# EAGLE design one_dollar_boad (EAGLE 7.5.0)
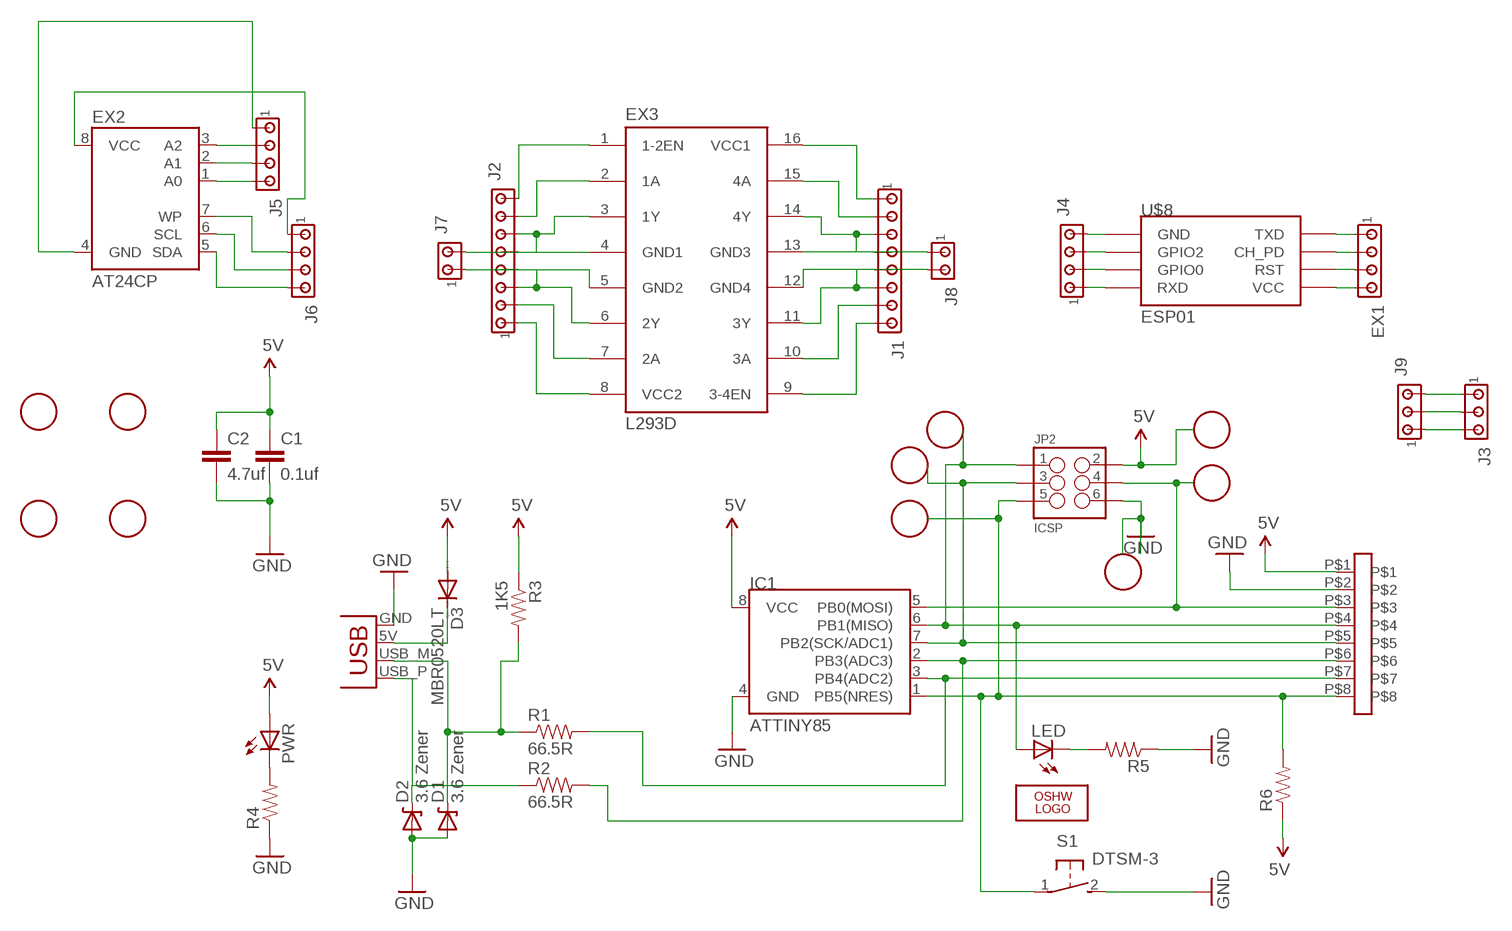
[diagram p0: schematic, sheet 1]

## Parts
C1  0.1uf  CAP0402-CAP  [0402-CAP]
C2  4.7uf  CAP0805  [0805]
CONNECTORBAR1  FAMALEBAR01X08  [FEMEABARRA01X08]
D1  3.6 Zener  DIODE-ZENER-BZT52  [SOD-323]
D2  3.6 Zener  DIODE-ZENER-BZT52  [SOD-323]
D3  MBR0520LT  [SOD123]
EX1  MTA04-100  [10X04MTA]
EX2  AT24CP  [DIL08]
EX3  L293D  [DIL16]
IC1  ATTINY85  ATTINY45  [SO08-EIAJ]
ICSP1  ICSP  [ICSP]
ICSP2  ICSP  [ICSP]
ICSP3  ICSP  [ICSP]
ICSP4  ICSP  [ICSP]
ICSP5  ICSP  [ICSP]
ICSP6  ICSP  [ICSP]
J1  MTA08-100  [10X08MTA]
J2  MTA08-100  [10X08MTA]
J3  MTA03-100  [10X03MTA]
J4  MTA04-100  [10X04MTA]
J5  MTA04-100  [10X04MTA]
J6  MTA04-100  [10X04MTA]
J7  MTA02-100  [10X02MTA]
J8  MTA02-100  [10X02MTA]
J9  MTA03-100  [10X03MTA]
JP2  ICSP  M03X22X3_SILK_MALE_PTH  [2X3]
LED  LED0603  [LED-0603]
LOGO2  LOGO-OSHW-10MILX0200-NT  [OSHW_10X200_NOTEXT]
PWR  LED0603  [LED-0603]
R1  66.5R  RESISTOR0402-RES  [0402-RES]
R2  66.5R  RESISTOR0402-RES  [0402-RES]
R3  1K5  RESISTOR0402-RES  [0402-RES]
R4  RESISTOR0402-RES  [0402-RES]
R5  RESISTOR0402-RES  [0402-RES]
R6  RESISTOR0402-RES  [0402-RES]
S1  DTSM-3  [DTSM-3]
U$8  ESP01  [ESP01]
U$9  ARDUINOPINAGEM  [ARDUINOPINAGEM]
X1  USBPCB  [USB-A-PCB]

## Nets
5V: C1.1 C2.1 CONNECTORBAR1.P$1 D3.A IC1.8(VCC) JP2.2 PWR.A R3.1 R6.1
GND: C1.2 C2.2 CONNECTORBAR1.P$2 D1.2(A) D2.2(A) IC1.4(GND) JP2.6 R4.1 R5.1 S1.2 X1.GND
N$1: CONNECTORBAR1.P$7 IC1.3(PB4(ADC2)) R1.2
N$2: CONNECTORBAR1.P$3 IC1.5(PB0(MOSI)) JP2.4
N$3: CONNECTORBAR1.P$4 IC1.6(PB1(MISO)) JP2.1 LED.A
N$5: CONNECTORBAR1.P$5 IC1.7(PB2(SCK/ADC1)) JP2.3
N$6: CONNECTORBAR1.P$6 IC1.2(PB3(ADC3)) R2.2
N$7: EX3.1(1-2EN) J2.8
N$9: EX3.2(1A) J2.7
N$10: D1.1(C) R1.1 R3.2 X1.USB_M(D-)
N$11: D2.1(C) R2.1 X1.USB_P(D+)
N$12: LED.C R5.2
N$13: EX2.8(VCC) J6.1
N$14: EX2.7(WP) J6.2
N$15: EX3.3(1Y) J2.6 J7.2
N$16: D3.C X1.5V(VBUS)
N$17: PWR.C R4.2
N$18: EX3.8(VCC2) J2.1
N$19: EX3.7(2A) J2.2
N$20: EX3.6(2Y) J2.3 J7.1
N$21: EX3.16(VCC1) J1.1
N$22: EX3.15(4A) J1.2
N$23: EX2.6(SCL) J6.3
N$24: EX2.5(SDA) J6.4
N$25: EX3.14(4Y) J1.3 J8.1
N$26: EX3.9(3-4EN) J1.8
N$27: EX3.10(3A) J1.7
N$28: EX2.3(A2) J5.2
N$29: J4.3 U$8.GPIO2
N$30: J4.2 U$8.GPIO0
N$31: J4.1 U$8.RX(RXD)
N$32: EX1.1 U$8.TX(TXD)
N$33: EX1.2 U$8.CH_PD
N$34: EX1.3 U$8.RST
N$35: EX1.4 U$8.VCC
N$36: EX2.2(A1) J5.3
N$37: EX2.1(A0) J5.4
N$38: EX3.11(3Y) J1.6 J8.2
N$41: CONNECTORBAR1.P$8 IC1.1(PB5(NRES)) JP2.5 R6.2 S1.1
N$46: J4.4 U$8.GND
N$47: EX2.4(GND) J5.1
N$48: EX3.5(GND2) J2.4
N$49: EX3.12(GND4) J1.5
N$50: EX3.13(GND3) J1.4
N$51: EX3.4(GND1) J2.5
N$52: J3.1 J9.3
N$53: J3.2 J9.2
N$54: J3.3 J9.1

## Library data of the parts
C1 C2 = SparkFun:CAP: Capacitor Standard 0603 ceramic capacitor, and 0.1" leaded capacitor.
CONNECTORBAR1 = femeabarra01x08:FAMALEBAR01X08: conector barra femea 01x08 SMD
D1 D2 = SparkFun:DIODE-ZENER: Zener Diode Production Part - 8199 3.4V Zener Voltage
D3 = diode:MBR0520LT: SCHOTTKY BARRIER RECTIFIER Source: http://onsemi.com .. MBR0520LT1-D.pdf
EX1 J4-J6 = con-amp:MTA04-100: AMP connector
EX2 = atmel:AT24C*: 2-wire serial EEPROM; MPN: AT24C1024BW-SH-B; OC_FARNELL: 1362646; OC_NEWARK: 03P2044
EX3 = st-microelectronics:L293D: PUSH-PULL 4 CHANNEL DRIVER; MPN: L293D; OC_FARNELL: 9589619; OC_NEWARK: 56P8249
IC1 = SparkFun:ATTINY45: Atmel ATTiny45
ICSP1-ICSP6 = ICSP:ICSP
J1 J2 = con-amp:MTA08-100: AMP connector
J3 J9 = con-amp:MTA03-100: AMP connector
J7 J8 = con-amp:MTA02-100: AMP connector
JP2 = SparkFun-Connectors:M03X2: 2x3 .1" header. Shrouded, with keying- CONN-10681 SMT- CONN-11415 Pogo pins- HW-11044; PROD_ID: CONN-09701
LED PWR = SparkFun:LED: LEDs Standard schematic elements and footprints for 5mm, 3mm, 1206, and 0603 sized LEDs. 5mm - Spark Fun Electronics SKU : COM-00529 (and others)
LOGO2 = logo:LOGO-OSHW-10MIL
R1-R5 = SparkFun:RESISTOR: Resistor Basic schematic elements and footprints for 0603, 1206, and PTH resistors.
R6 = SparkFun-Passives:RESISTOR: Resistor Basic schematic elements and footprints for 0603, 1206, and PTH resistors.
S1 = switch-tact:DTSM-3
U$8 = esp8266modules:ESP01: ESP8266 Wifi module 01
U$9 = arduinopinagem:ARDUINOPINAGEM
X1 = SparkFun:USB: USB Connectors USB-B-PTH is fully proven SKU : PRT-00139 USB-miniB is fully proven SKU : PRT-00587 USB-A-PCB is untested. USB-A-H is throughly reviewed, but untested. Spark Fun Electronics SKU : PRT-00437 USB-B-SMT is throughly reviewed, but untested. Needs silkscreen touching up. USB-A-S has not been used/tested USB-MB-H has not been used/tested

## Board
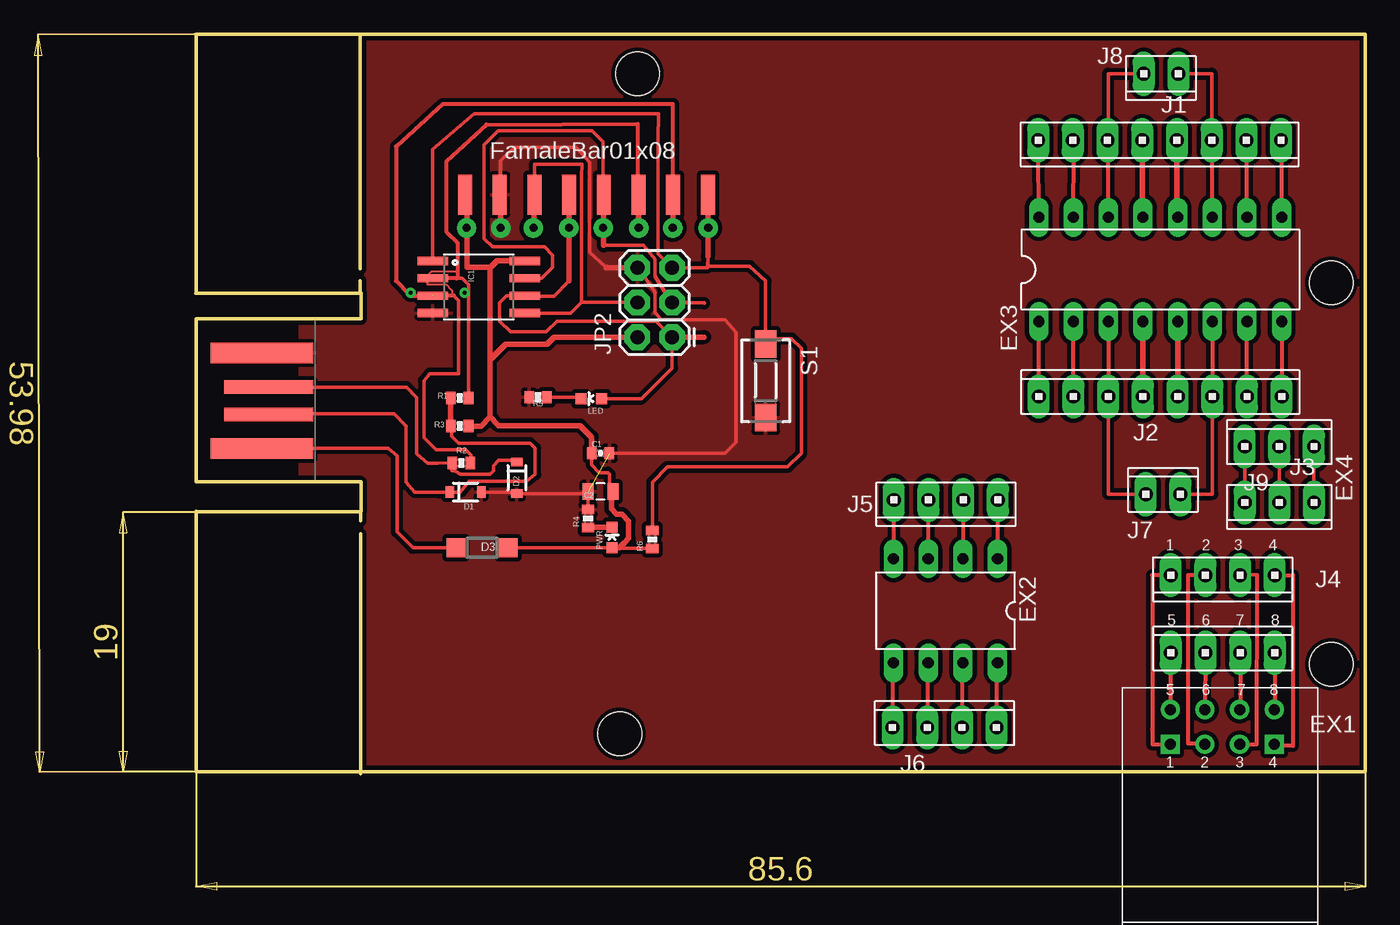
[diagram p1: board, top side]
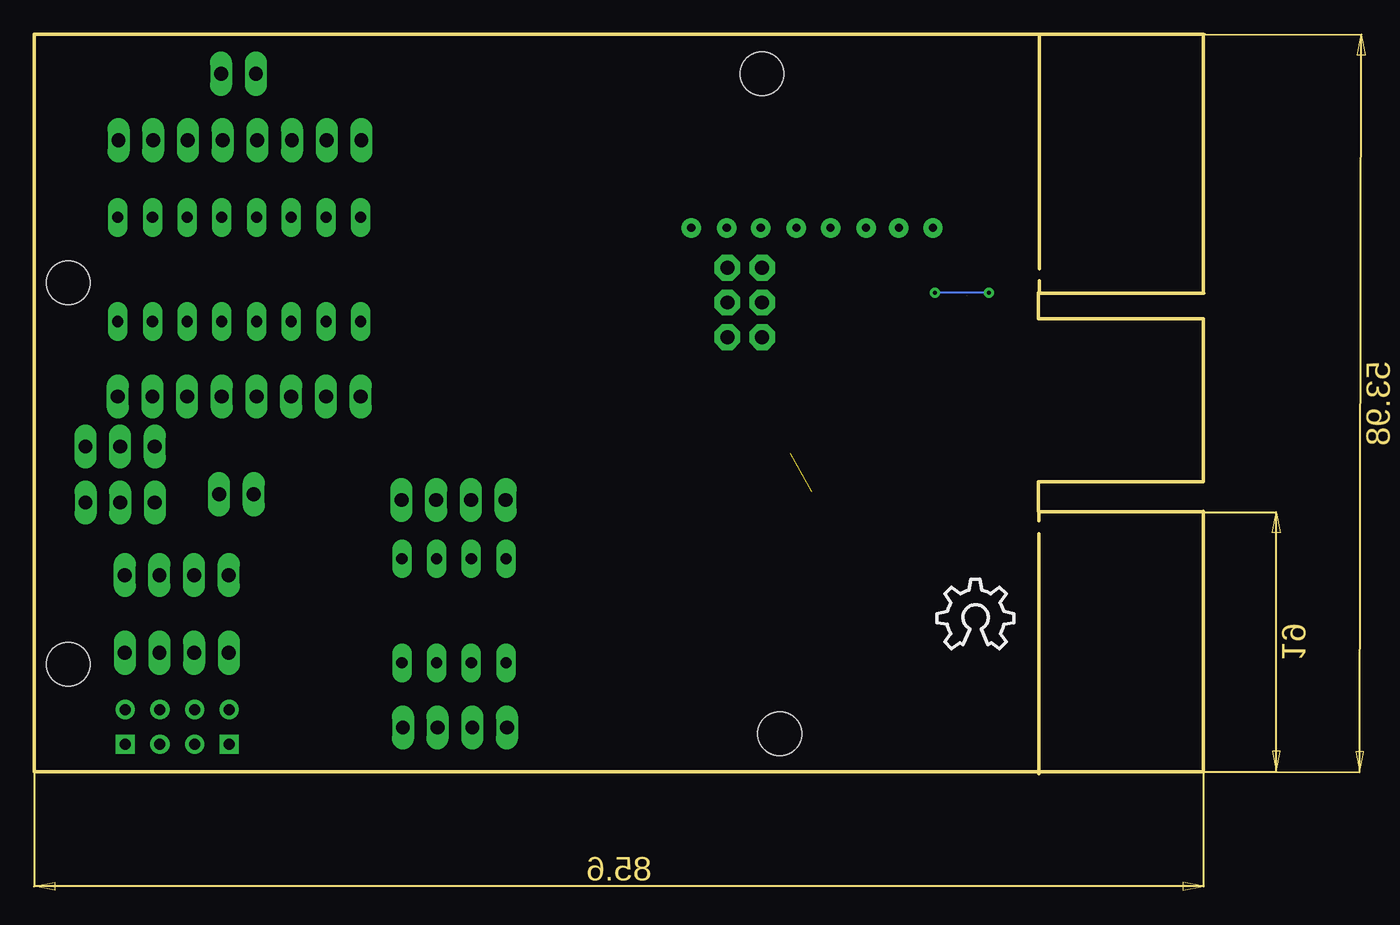
[diagram p2: board, bottom side, seen from below]

Size 85.62 x 54.14 mm. Coordinates in mm from the lower left corner, seen from the top.
Outline: 9.02,0.17 26.52,0.17
Outline: 0.02,19.22 0.02,0.17 85.62,0.17 85.62,54.14 0.02,54.14 0.02,35.22
Outline: 12.08,19.22 12.08,21.38 0.02,21.38 0.02,33.31 12.08,33.31 12.08,35.22
Outline: 12.03,36.11 12.03,35.13
Outline: 12.03,46.6 12.03,45.89
Outline: 12.03,47.72 12.03,47
Outline: 12.03,48.83 12.03,48.12
Outline: 12.03,49.98 12.03,49.26
Outline: 12.03,51.14 12.03,50.43
Outline: 12.03,52.26 12.03,51.55
Outline: 12.03,54.08 12.03,36.97
Outline: 10.79,35.19 11.5,35.19
Outline: 9.67,35.19 10.38,35.19
Outline: 8.55,35.19 9.26,35.19
Outline: 7.38,35.19 8.09,35.19
Outline: 6.27,35.19 6.98,35.19
Outline: 5.15,35.19 5.86,35.19
Outline: 4.03,35.19 4.74,35.19
Outline: 2.91,35.19 3.62,35.19
Outline: 1.8,35.19 2.51,35.19
Outline: 0,35.19 12.06,35.19
Outline: 12.06,18.53 12.06,19.24
Outline: 12.06,12.31 12.06,13.02
Outline: 12.06,11.19 12.06,11.9
Outline: 12.06,7.79 12.06,8.5
Outline: 12.06,6.67 12.06,7.38
Outline: 12.06,5.55 12.06,6.26
Outline: 12.06,4.41 12.06,5.12
Outline: 12.06,3.24 12.06,3.95
Outline: 12.06,2.12 12.06,2.83
Outline: 12.06,0 12.06,17.57
Outline: 0.06,19.19 12.07,19.19
Outline: 9.64,19.19 10.36,19.19
Outline: 8.53,19.19 9.24,19.19
Outline: 7.36,19.19 8.07,19.19
Outline: 6.24,19.19 6.95,19.19
Outline: 5.12,19.19 5.83,19.19
Outline: 4.01,19.19 4.72,19.19
Outline: 2.89,19.19 3.6,19.19
Outline: 1.77,19.19 2.48,19.19
Outline: 0.47,19.19 1.34,19.19
Copper layers (1*16): Top 0.035mm / dielectric 1.5mm / Bottom 0.035mm
Design rules "DFRobot_Eagle_Rule_v0.4": minimum track width 6mil, minimum drill 12mil, track to track 6mil, track to pad 6mil, pad to pad 6mil, via to via 6mil, smd to smd 0mil, copper to edge 10mil, drill to drill 10mil, minimum pad ring 12mil, minimum via ring 8mil, stop-mask expansion 2mil, vias tented up to drill 25mil, thermal gap 10mil

### Footprints (pad centres in the part's own frame; a part is rotated, then mirrored left to right if it is on the bottom)
0402-CAP = smd 0.7 x 0.9: 1 -0.65,0; 2 0.65,0
0805 = smd 0.8 x 1.2: 1 -0.9,0; 2 0.9,0
FEMEABARRA01X08 = smd 1.02 x 2.9: P$1 0,0; P$2 2.54,0; P$3 5.08,0; P$4 7.62,0; P$5 10.16,0; P$6 12.7,0; P$7 15.24,0; P$8 17.78,0
SOD-323 = smd 0.63 x 0.83: 1 -1.15,0; 2 1.15,0
SOD123 = smd 1.4 x 1.4: A 1.9,0; C -1.9,0
10X04MTA = drill 1.016 long: 1 3.81,0; 2 1.27,0; 3 -1.27,0; 4 -3.81,0
DIL08 = drill 0.813 long: 1 -3.81,-3.81; 2 -1.27,-3.81; 3 1.27,-3.81; 4 3.81,-3.81; 5 3.81,3.81; 6 1.27,3.81; 7 -1.27,3.81; 8 -3.81,3.81
DIL16 = drill 0.813 long: 1 -8.89,-3.81; 2 -6.35,-3.81; 3 -3.81,-3.81; 4 -1.27,-3.81; 5 1.27,-3.81; 6 3.81,-3.81; 7 6.35,-3.81; 8 8.89,-3.81; 9 8.89,3.81; 10 6.35,3.81; 11 3.81,3.81; 12 1.27,3.81; 13 -1.27,3.81; 14 -3.81,3.81; 15 -6.35,3.81; 16 -8.89,3.81
SO08-EIAJ = smd 0.61 x 2.21: 1 -1.905,-3.378; 2 -0.635,-3.378; 3 0.635,-3.378; 4 1.905,-3.378; 5 1.905,3.353; 6 0.635,3.353; 7 -0.635,3.353; 8 -1.905,3.353
10X08MTA = drill 1.016 long: 1 8.89,0; 2 6.35,0; 3 3.81,0; 4 1.27,0; 5 -1.27,0; 6 -3.81,0; 7 -6.35,0; 8 -8.89,0
10X03MTA = drill 1.016 long: 1 2.54,0; 2 0,0; 3 -2.54,0
10X02MTA = drill 1.016 long: 1 1.27,0; 2 -1.27,0
2X3 = drill 1.016 pad 1.88 octagon: 1 0,0; 2 0,2.54; 3 2.54,0; 4 2.54,2.54; 5 5.08,0; 6 5.08,2.54
LED-0603 = smd 0.8 x 0.8: A 0,-0.75; C 0,0.75
0402-RES = smd 0.7 x 0.9: 1 -0.65,0; 2 0.65,0
DTSM-3 = smd 2 x 1.6: 1 -2.7,0; 2 2.7,0
ESP01 = drill 0.8: CH_PD -1.285,-8.178; GPIO0 1.255,-5.638; GPIO2 -1.285,-5.638; RST 1.255,-8.178; TX -3.825,-8.178; VCC 3.795,-8.178 | drill 0.8 square: GND -3.825,-5.638; RX 3.795,-5.638
ARDUINOPINAGEM = hole 3.2: 0,0; 1.3,48.3; 52.1,5.1; 52.1,33
USB-A-PCB = smd 7.5 x 1.5: 5V -0.2,-3.5; GND -0.2,3.5 | smd 6.5 x 1: USB_M 0.3,-1; USB_P 0.3,1

### Placement (x,y rotation side)
C1  29.63,23.48 0 top
C2  29.63,20.67 180 top
CONNECTORBAR1  19.7,42.39 0 top
D1  19.74,20.63 0 top
D2  23.49,21.67 270 top
D3  20.96,16.55 0 top
EX1  75.18,8.88 0 top
EX2  54.88,11.94 180 top
EX3  70.6,36.92 0 top
IC1  20.73,35.64 270 top
ICSP1  37.22,37.17 0 top
ICSP2  37.22,34.47 0 top
ICSP3  37.22,32.07 0 top
ICSP4  30.02,37.17 0 top
ICSP5  30.02,34.57 0 top
ICSP6  30.02,31.97 0 top
J1  70.55,46.39 180 top
J2  70.6,27.62 0 top
J3  79.32,19.87 180 top
J4  75.17,14.56 180 top
J5  54.91,20.05 180 top
J6  54.81,3.4 0 top
J7  70.81,20.47 0 top
J8  70.65,51.25 180 top
J9  79.32,23.97 0 top
JP2  34.87,31.97 90 top
LED  28.95,27.46 90 top
LOGO2  19.54,9.18 0 bottom
PWR  30.46,17.31 0 top
R1  19.32,27.51 0 top
R2  19.44,22.77 0 top
R3  19.32,25.46 180 top
R4  28.71,18.7 270 top
R5  25.05,27.58 0 top
R6  33.42,17.17 90 top
S1  41.72,28.78 270 top
U$8  75.13,-3.47 180 top
U$9  31.03,2.94 0 top
X1  5.02,27.32 0 top

### Tracks (layer width: path | path; a pad name or v marks a point on that pad's centre or on a via)
5V
  Top 0.254: D3.A 30.45,16.55 PWR.A | IC1.8 24.09,37.56 24.6,37.35 24.6,37.43 | C1.1 28.98,22.61 29.53,22.06 30.17,22.06 30.29,21.93 30.29,20.9 C2.1 | R6.1 31.07,16.52 31.37,16.91
  Top 0.406: PWR.A 31.02,16.56 31.37,16.91 31.69,17.24 31.69,18.51 31.18,19.01 30.8,19.01 30.42,19.39 30.42,20.56 C2.1 | R3.1 20.86,25.46 21.53,26.13 | 21.53,26.13 21.53,30.32 | 21.53,30.32 21.53,37.05 | 21.53,37.05 22.04,37.56 IC1.8 | 21.53,30.32 22.67,31.46 25.72,31.46 26.23,31.97 JP2.2 | C1.1 28.98,24.64 28.14,25.49 22.17,25.49 21.53,26.13 | CONNECTORBAR1.P$1 19.85,42.39 19.85,37.1 21.53,37.1 21.53,37.05
GND  (via drill 0.6 pad 1.42)  (1 unrouted)
  Top 0.152: JP2.6 32.36,37.07
  Top 0.254: D1.2 23.48,20.63 D2.2 28.58,20.52 C2.2 28.73,19.37 R4.1 | 32.35,37.07 32.36,37.07 33.6,35.27 33.6,33.75 34.1,33.24 38.74,33.24 39.55,32.33 39.55,24.27 38.74,23.46 30.3,23.46 C1.2 | CONNECTORBAR1.P$2 22.34,42.29 22.34,41.89 22.32,41.86 | 22.32,42.57 22.32,44.87 23.32,45.87 27.82,45.87 28.82,44.77 28.82,38.17 30.02,37.07 32.31,37.07 JP2.6
  Top 0.406: 22.32,41.86 v22.32,39.97 | v22.32,39.97 22.32,39.47 | v22.32,39.97 22.32,42.57 | JP2.6 30.02,37.05 30.02,37.07
  pour Top (isolate 0.305): 0.14,0.14 85.62,0.17 85.62,54.14 0.02,54.17 -0.03,35.19 12.08,35.22 12.08,33.31 7.64,33.31 7.64,21.38 12.08,21.38 12.08,19.22 0.02,19.17 0.02,0.27
N$1  (via drill 0.3)  (1 unrouted)
  Top 0.152: v19.68,35.22 19.97,35.22 19.98,35.22 | v15.71,35.22 15.61,35.12
  Top 0.254: R1.2 19.97,35.22 19.97,35.82 19.5,36.29 17.36,36.29
  Top 0.305: 34.94,39.51 34.92,49.03 18.07,49.03 14.65,45.91 14.65,36.08 15.61,35.12 15.74,34.99 17.34,34.99
  Top 0.406: CONNECTORBAR1.P$7 34.94,39.51
  Bottom 0.152: v15.71,35.22 v19.68,35.22
N$2
  Top 0.254: 27.44,33.73 28.25,34.53 JP2.4 | IC1.5 27.44,33.73 | 27.44,33.73 28.25,34.54 28.25,43.74 28.27,44.62 24.81,44.62 24.76,39.47 | 24.76,42.42 CONNECTORBAR1.P$3
  Top 0.406: 24.76,39.47 24.76,42.42
N$3
  Top 0.254: 27.32,36.08 26.2,34.96 24.12,34.96 IC1.6 22.76,35 22.24,34.48 22.24,33.14 23.03,32.35 25.65,32.35 26.43,33.14 33.7,33.14 JP2.1 34.87,29.71 32.62,27.46 LED.A
  Top 0.406: CONNECTORBAR1.P$4 27.32,36.08
N$4
  Top 0.406: 34.82,31.97 37.22,31.97
N$5
  Top 0.254: 29.85,38.68 32.78,38.68 33.6,37.66 33.6,36.41 34.81,34.5 37.21,34.46 | IC1.7 25.32,36.27 26.12,37.07 26.12,37.97 25.52,38.57 21.72,38.57 21.12,39.17 21.12,46.07 22.12,47.07 29.02,47.07 29.82,46.27 29.82,42.44 CONNECTORBAR1.P$5
  Top 0.305: CONNECTORBAR1.P$5 29.96,42.28 30,42.33 30.17,42.46 29.94,42.68 29.94,42.49 29.95,41.71 29.96,41.87 | 37.21,34.46 JP2.3
  Top 0.406: CONNECTORBAR1.P$5 29.86,40.46 29.85,38.68
N$6
  Top 0.152: 19.14,36.74 17.24,36.74 16.93,36.44 16.93,35.83 18.31,35.83 18.76,35.37 18.76,35.07 18.88,35
  Top 0.254: 18.88,35 19.25,34.63 19.25,29.27 18.23,29.3 17.11,29.3 16.71,28.79 16.71,24.6 17.59,23.71 19.75,23.71 20.13,23.33 20.13,22.68 R2.2
  Top 0.305: 18.88,35 17.38,35 17.37,34.99 17.34,34.99 17.34,35.02 | 32.4,39.49 32.36,47.58 21.27,47.53 18.33,44.79 18.33,39.69 19.14,38.88 19.14,36.74 19.14,36.29 19.07,36.29 19.07,36.27 IC1.2
  Top 0.406: CONNECTORBAR1.P$6 32.4,39.49
N$7
  Top 0.305: J2.8 EX3.1
N$8  (via drill 0.6 pad 1.42)
  other vias: 19.82,39.97
N$9
  Top 0.305: J2.7 EX3.2
N$10
  Top 0.254: R3.2 18.74,25.38 18.74,24.73 19.25,24.22 24.45,24.22 24.83,23.84 24.83,21.93 24.2,21.43 20.01,21.43 19.34,20.63 D1.1 17.67,20.63 16.02,20.63 15.38,21.36 15.38,25.46 14.5,26.35 5.35,26.35 X1.USB_M
  Top 0.406: R3.2 R1.1
N$11
  Top 0.254: 18.79,22.26 19.37,21.93 21.53,21.93 21.79,22.19 21.79,22.57 22.17,22.95 23.49,22.95 | R2.1 17.68,22.76 16.95,22.76 16.17,23.43 16.17,27.55 15.41,28.31 7.99,28.31 7.97,28.34 5.33,28.34 X1.USB_P
  Top 0.406: R2.1 18.79,22.26 | 23.49,22.95 D2.1
N$12
  Top 0.254: R5.2 28.09,27.58 LED.C
N$13
  Top 0.254: EX2.8 58.62,8.13
  Top 0.305: 58.62,8.13 J6.1
N$14
  Top 0.254: EX2.7 56.08,8.13
  Top 0.305: 56.08,8.13 J6.2
N$15
  Top 0.254: J7.2 66.79,20.47 J2.6
  Top 0.305: EX3.3 J2.6
N$16
  Top 0.254: D3.C 15.89,16.55 14.72,17.72 14.72,23.31 14.09,23.84 4.84,23.84 X1.5V
N$17
  Top 0.254: 30.45,18.05 PWR.C
  Top 0.406: R4.2 30.46,18.05 PWR.C
N$18
  Top 0.305: EX3.8 J2.1
N$19
  Top 0.305: J2.2 EX3.7
N$20
  Top 0.254: J7.1 74.41,20.47 J2.3
  Top 0.305: EX3.6 J2.3
N$21
  Top 0.254: 61.69,45.71 J1.1
  Top 0.305: EX3.16 61.69,45.71
N$22
  Top 0.254: 64.28,45.76 J1.2
  Top 0.305: EX3.15 64.28,45.76
N$23
  Top 0.254: EX2.6 53.54,8.13
  Top 0.305: 53.54,8.13 J6.3
N$24
  Top 0.254: EX2.5 51,8.13
  Top 0.305: 51,8.13 J6.4
N$25
  Top 0.254: 66.79,45.73 J1.3 66.79,45.78 66.79,51.25 J8.1
  Top 0.305: EX3.14 66.79,45.73
N$26
  Top 0.254: 79.49,45.73 J1.8
  Top 0.305: EX3.9 79.49,45.73
N$27
  Top 0.254: 76.95,45.73 J1.7
  Top 0.305: EX3.10 76.95,45.73
N$28
  Top 0.254: EX2.3 53.64,15.75
  Top 0.305: 53.64,15.75 J5.2
N$29
  Top 0.254: 76.47,14.58 J4.3
  Top 0.305: U$8.GPIO2 77.67,2.17 77.69,14.55 76.47,14.58
N$30
  Top 0.254: 73.9,2.25 U$8.GPIO0
  Top 0.305: J4.2 72.64,14.56 72.64,2.25 73.9,2.25
N$31
  Top 0.305: J4.1 70.02,14.56 70.02,3.27 70.03,2.17 U$8.RX
N$32
  Top 0.305: EX1.1 78.99,5.84 U$8.TX
N$33
  Top 0.305: EX1.2 76.45,5.84 U$8.CH_PD
N$34
  Top 0.254: EX1.3 73.9,8.85
  Top 0.305: 73.9,8.85 U$8.RST
N$35
  Top 0.305: U$8.VCC 71.37,5.83 EX1.4
N$36
  Top 0.254: EX2.2 56.18,15.75
  Top 0.305: 56.18,15.75 J5.3
N$37
  Top 0.254: EX2.1 58.72,15.75
  Top 0.305: 58.72,15.75 J5.4
N$38
  Top 0.254: 74.41,45.73 J1.6 74.36,51.25 J8.2
  Top 0.305: EX3.11 74.41,45.73
N$39  (via drill 0.6 pad 1.42)
  other vias: 24.72,39.97
N$40  (via drill 0.6 pad 1.42)
  other vias: 27.32,39.97
N$41
  Top 0.254: IC1.1 17.35,45.72 20.35,48.32 33.85,48.32 33.82,46.45 33.82,38.09 JP2.5 37.44,37.05 37.48,37.89 37.51,37.16 40.55,37.16 41.72,36.09 S1.1 42.11,31.87 43.62,31.87 44.32,31.17 44.32,23.47 43.32,22.47 34.52,22.47 33.42,21.37 R6.2
  Top 0.406: CONNECTORBAR1.P$8 37.48,37.89
N$42  (via drill 0.6 pad 1.42)
  other vias: 29.82,39.97
N$43  (via drill 0.6 pad 1.42)
  other vias: 32.42,39.97
N$44  (via drill 0.6 pad 1.42)
  other vias: 34.92,39.97
N$45  (via drill 0.6 pad 1.42)
  other vias: 37.52,39.97
N$46
  Top 0.305: J4.4 80.32,14.56 80.32,2.07 78.95,2.07
  Top 0.406: 78.95,2.07 U$8.GND
N$47
  Top 0.305: 51.1,15.75 J5.1
  Top 0.406: EX2.4 51.1,15.75
N$48
  Top 0.406: J2.4 EX3.5
N$49
  Top 0.406: EX3.12 71.82,40.73 J1.5
N$50
  Top 0.406: EX3.13 69.28,40.73 J1.4
N$51
  Top 0.406: EX3.4 J2.5
N$52
  Top 0.254: J3.1 J9.3
N$53
  Top 0.254: J3.2 J9.2
N$54
  Top 0.254: J3.3 J9.1

### Text on the board
tPlace: EX4 | 1 | 2 | 3 | 4 | 5 | 6 | 7 | 8 | 5 | 6 | 7 | 8 | 1 | 2 | 3 | 4
Reference: The "One Dollar Board" Desing (schematic, layout, concept) is licensed under the Creative Commons Attribution-ShareAlike 3.0 Unported License: http://creativecommons.org/licenses/by-sa/3.0/ | For full details and license information please see http://onedollarboard.com/policy | The "Onde Dollar Board" and Centro Maker names and logos (or derivatives thereof) may not be used as part of the name of a product, company, or domain name without express written permission. | "One Dollar Board" name. logo and Centro Maker name, logo Copyright 2015 Centro Maker Tecnologia Ltda. and Claudio Olmedo All Rights Reserved